# Altium schematic sheet Thermosistor2.SchDoc
size A4; SheetNumber: 3; SheetTotal: 11
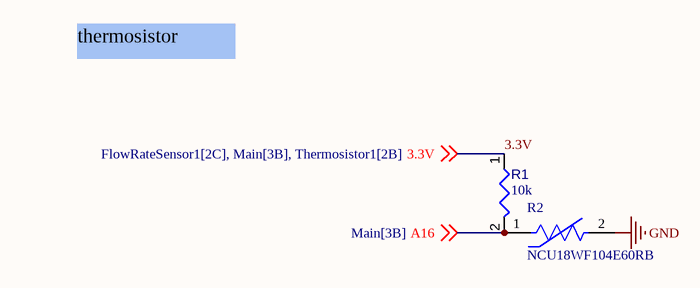
[diagram p0: Thermosistor2.SchDoc]

## Parts
R1  value 10k  [RESC0402(1005)_L]  (hidden comment: Resistor 10K  +/-1 % 0402 63 mW)
R2  NCU18WF104E60RB  [FP-NCU18-0_15-IPC_C]

## Nets
GND: R2.2
3.3V: R1.1 ; off-sheet 3.3V
A16: R1.2 R2.1 ; off-sheet A16

## Notes on the sheet
- thermosistor

## Library data of the parts
R1 = CMP-009-00149-3: Chip Resistor, 10 kOhms, +/-1 %, 63 mW, -55 to 125 degC, 0402; Power: 63mW; Tolerance: 1%; Min Operating Temperature: -55°C; Case/Package: 0402; Max Operating Temperature: 155°C; Pins: 2
R2 = CMP-06022-000229-2: THERMISTOR NTC